# Altium schematic sheet Buzzer.SchDoc
size 76 x 50 mm
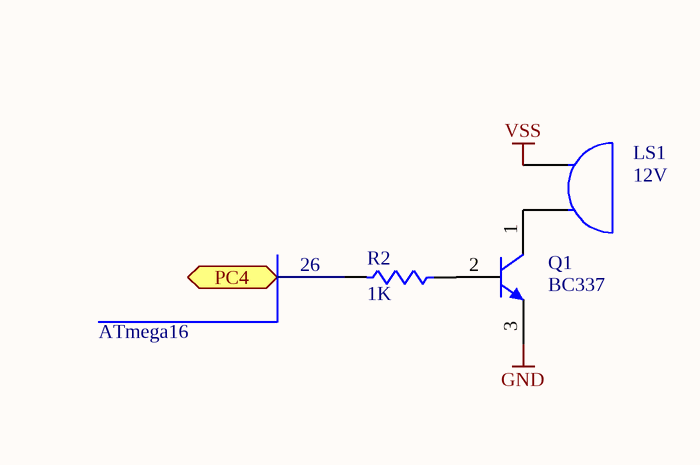
[diagram p0: Buzzer.SchDoc]

## Parts
LS1  value 12V  [RB_7.62mm]  (hidden comment: Buzzer)
Q1  Device: BC337  [TO92C]  (hidden comment: NPN)
R2  value 1K  [AXIAL0.4]  (hidden comment: Resistor)

## Ports
PC4

## Nets
GND: Q1.3(E)
VSS: LS1.1(A)
PC4: R2.2 ; port PC4
NetLS1_2: LS1.2(B) Q1.1(C)
NetQ1_2: Q1.2(B) R2.1

## Notes on the sheet
- (near R2) 26
- ATmega16

## Library data of the parts
LS1 = Buzzer: Sounder; Manufacturer: Generic Components; Published: 24-Mar-1999; Revision: July-2002: Re-released for DXP Platform.; Publisher: Altium Limited
Q1 = NPN: Silicon Bipolar Transistor; Package Reference: TO-92A
R2 = Resistor: Manufacturer: Generic Components; Revision: July-2002: Re-released for DXP Platform.; Publisher: Altium Limited